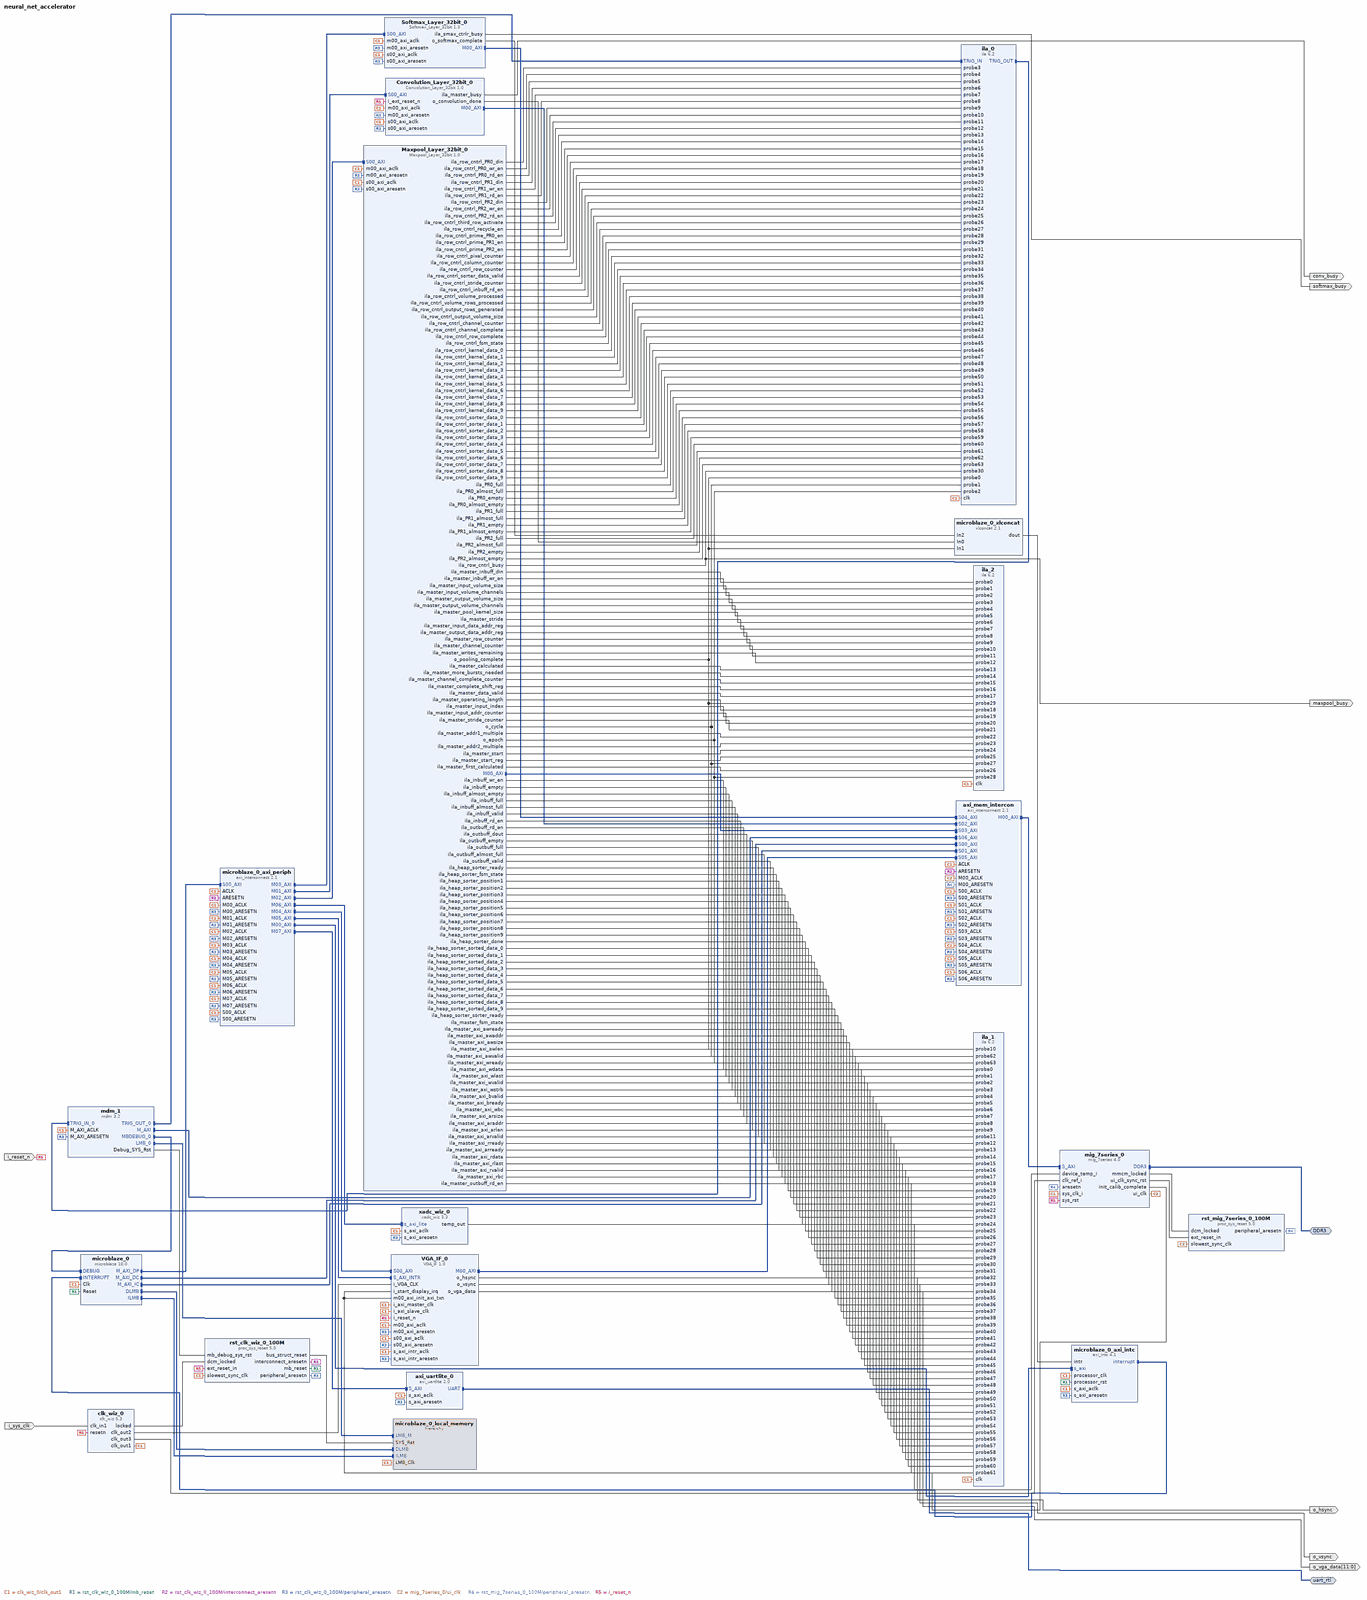
[diagram p0: block diagram of the top level, whole]
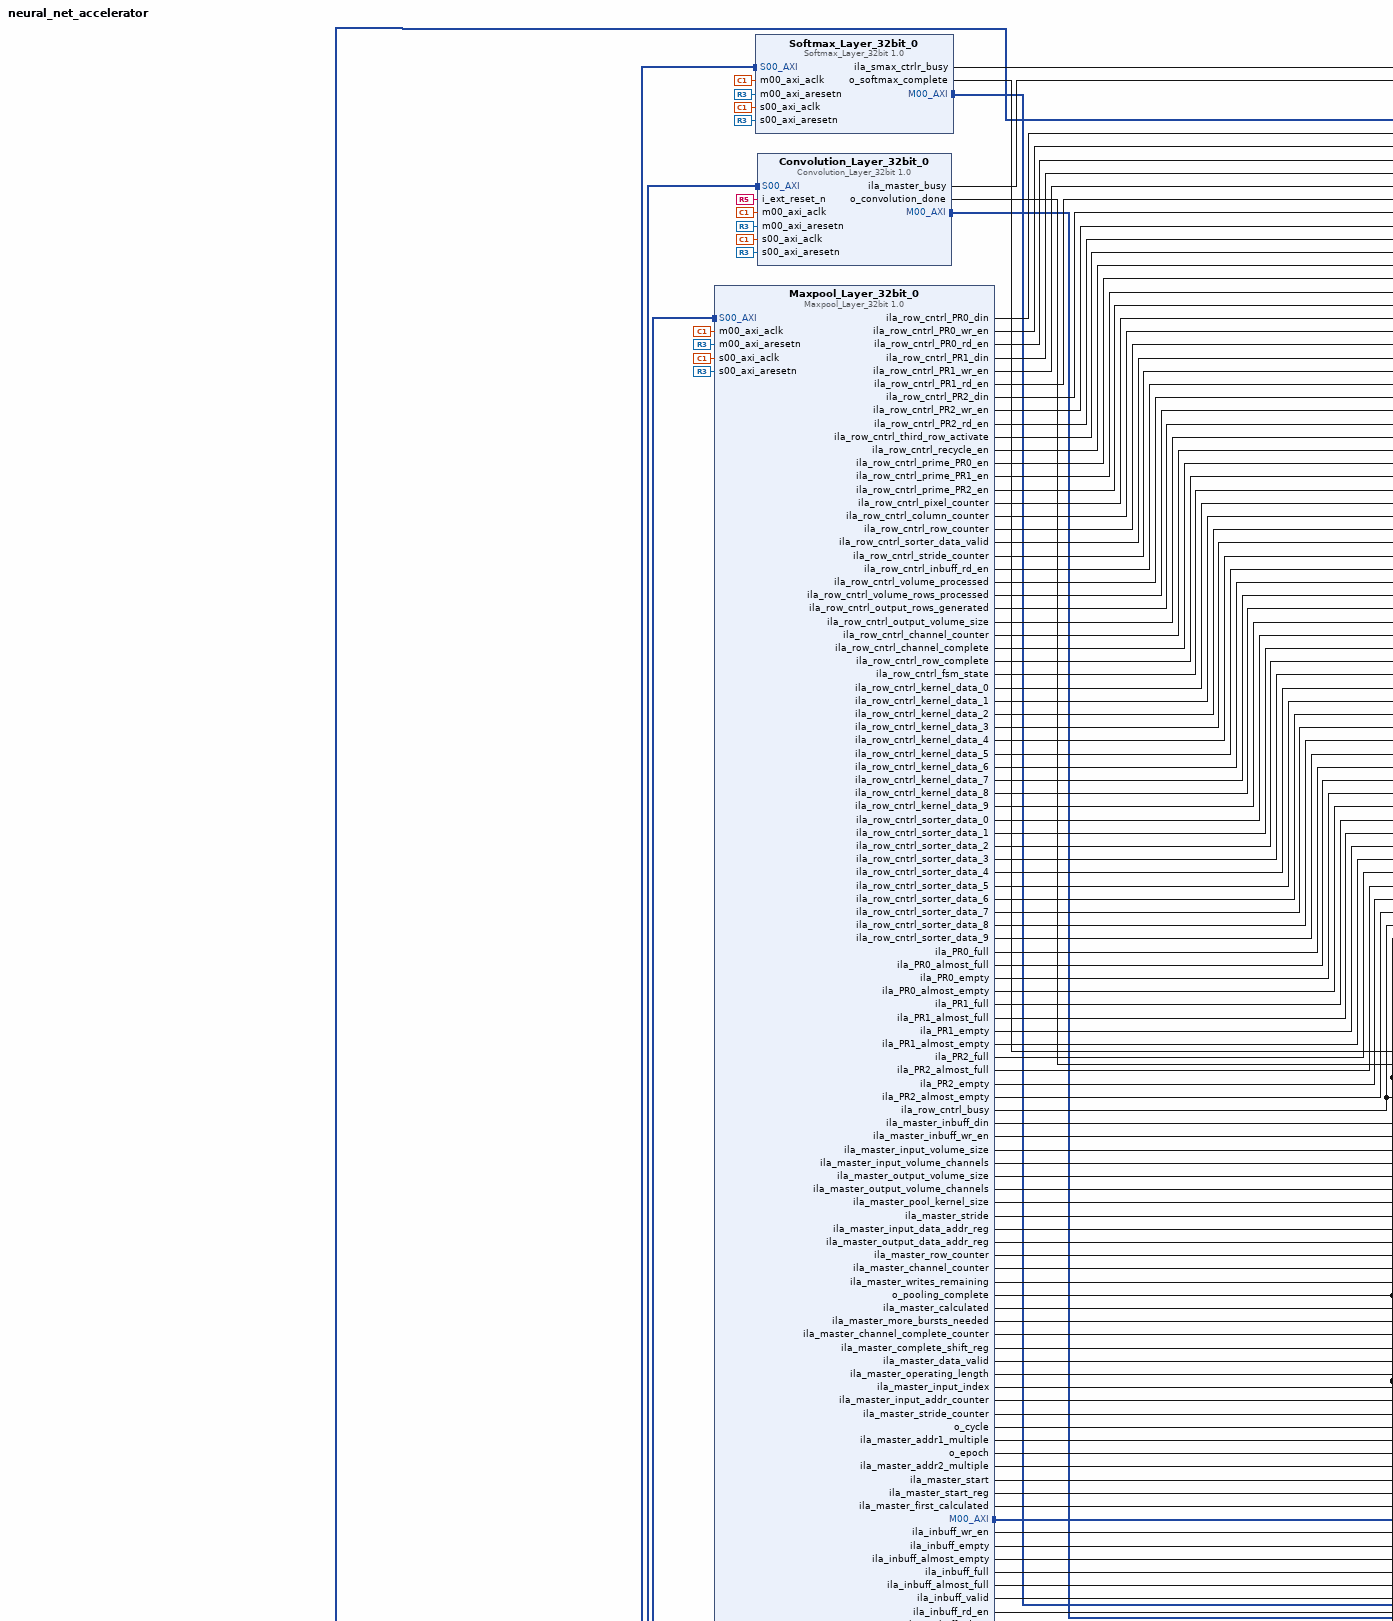
[diagram p1: block diagram of the top level, upper left part]
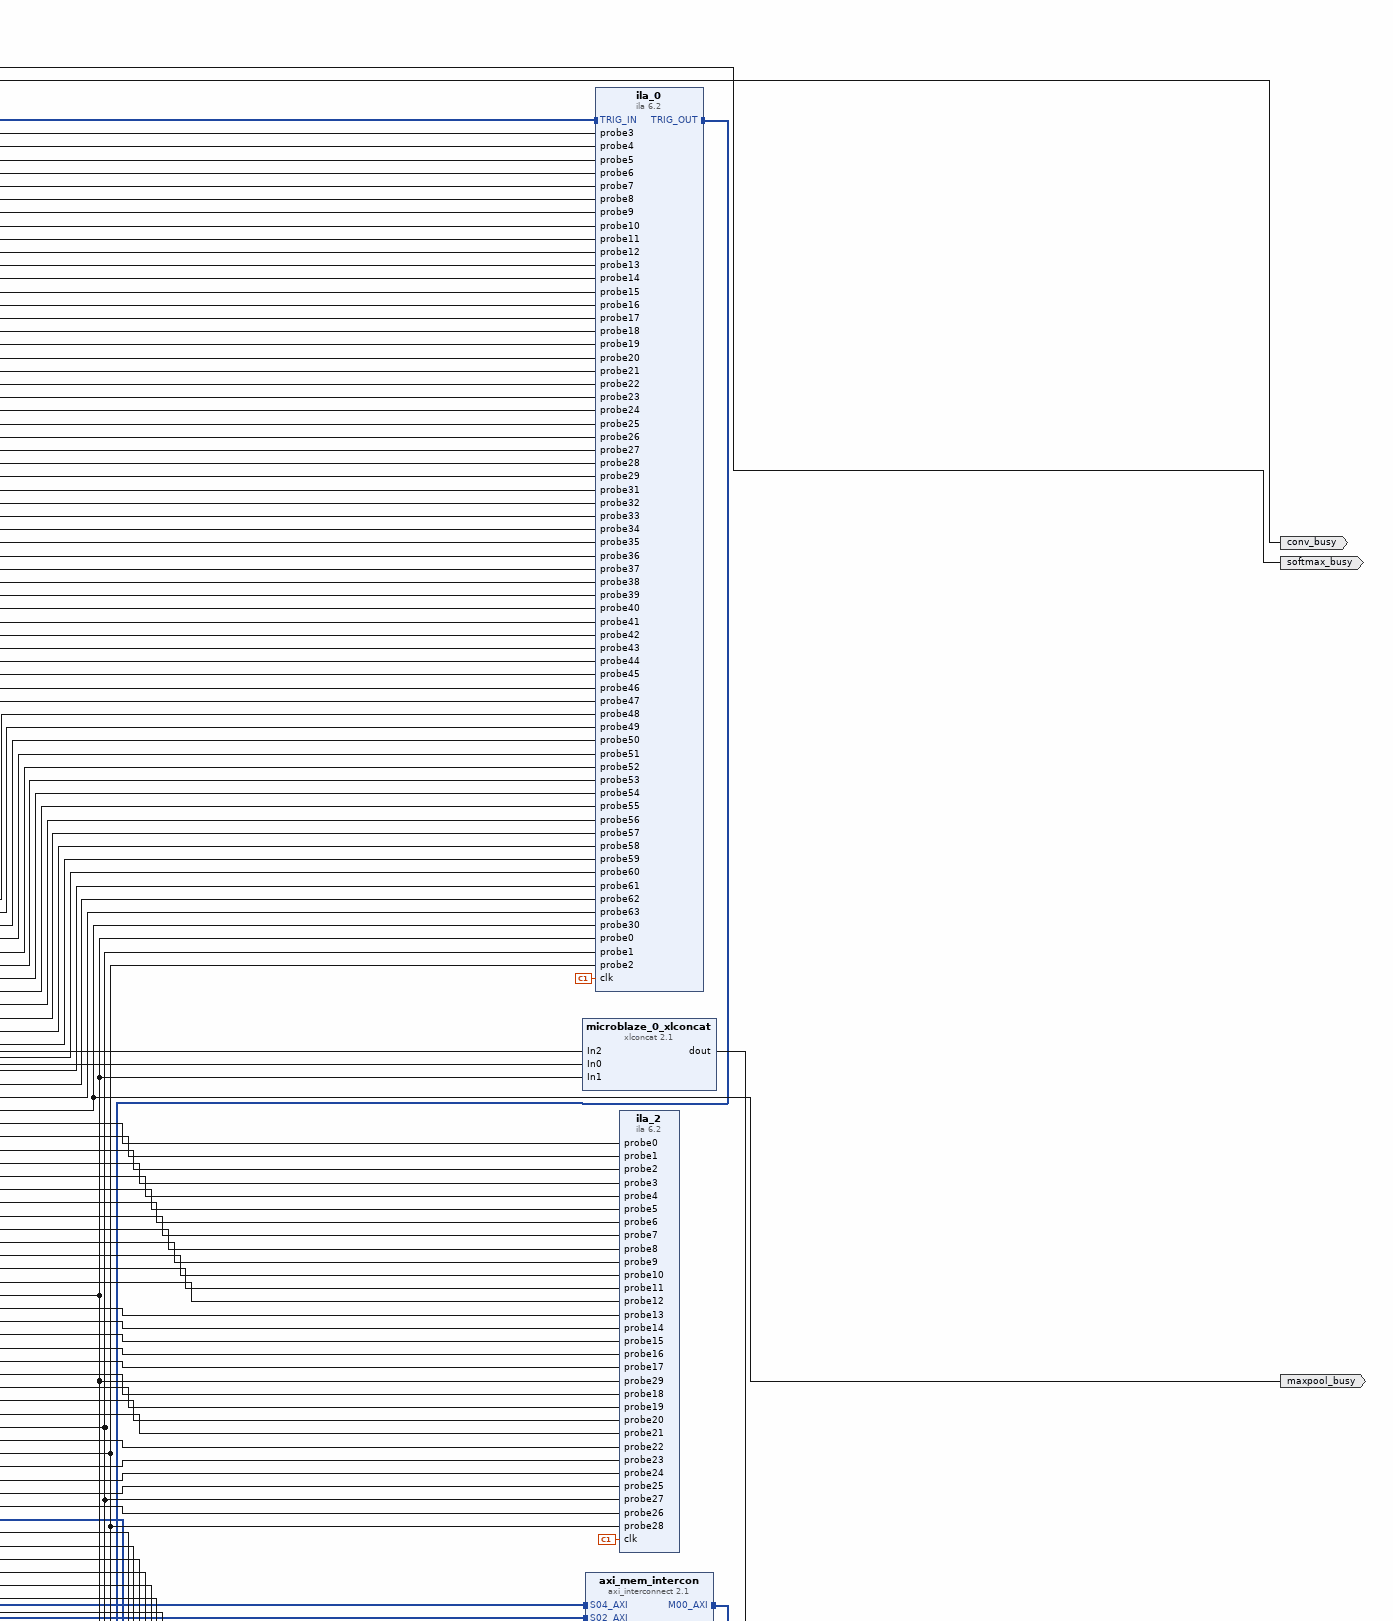
[diagram p2: block diagram of the top level, upper right part]
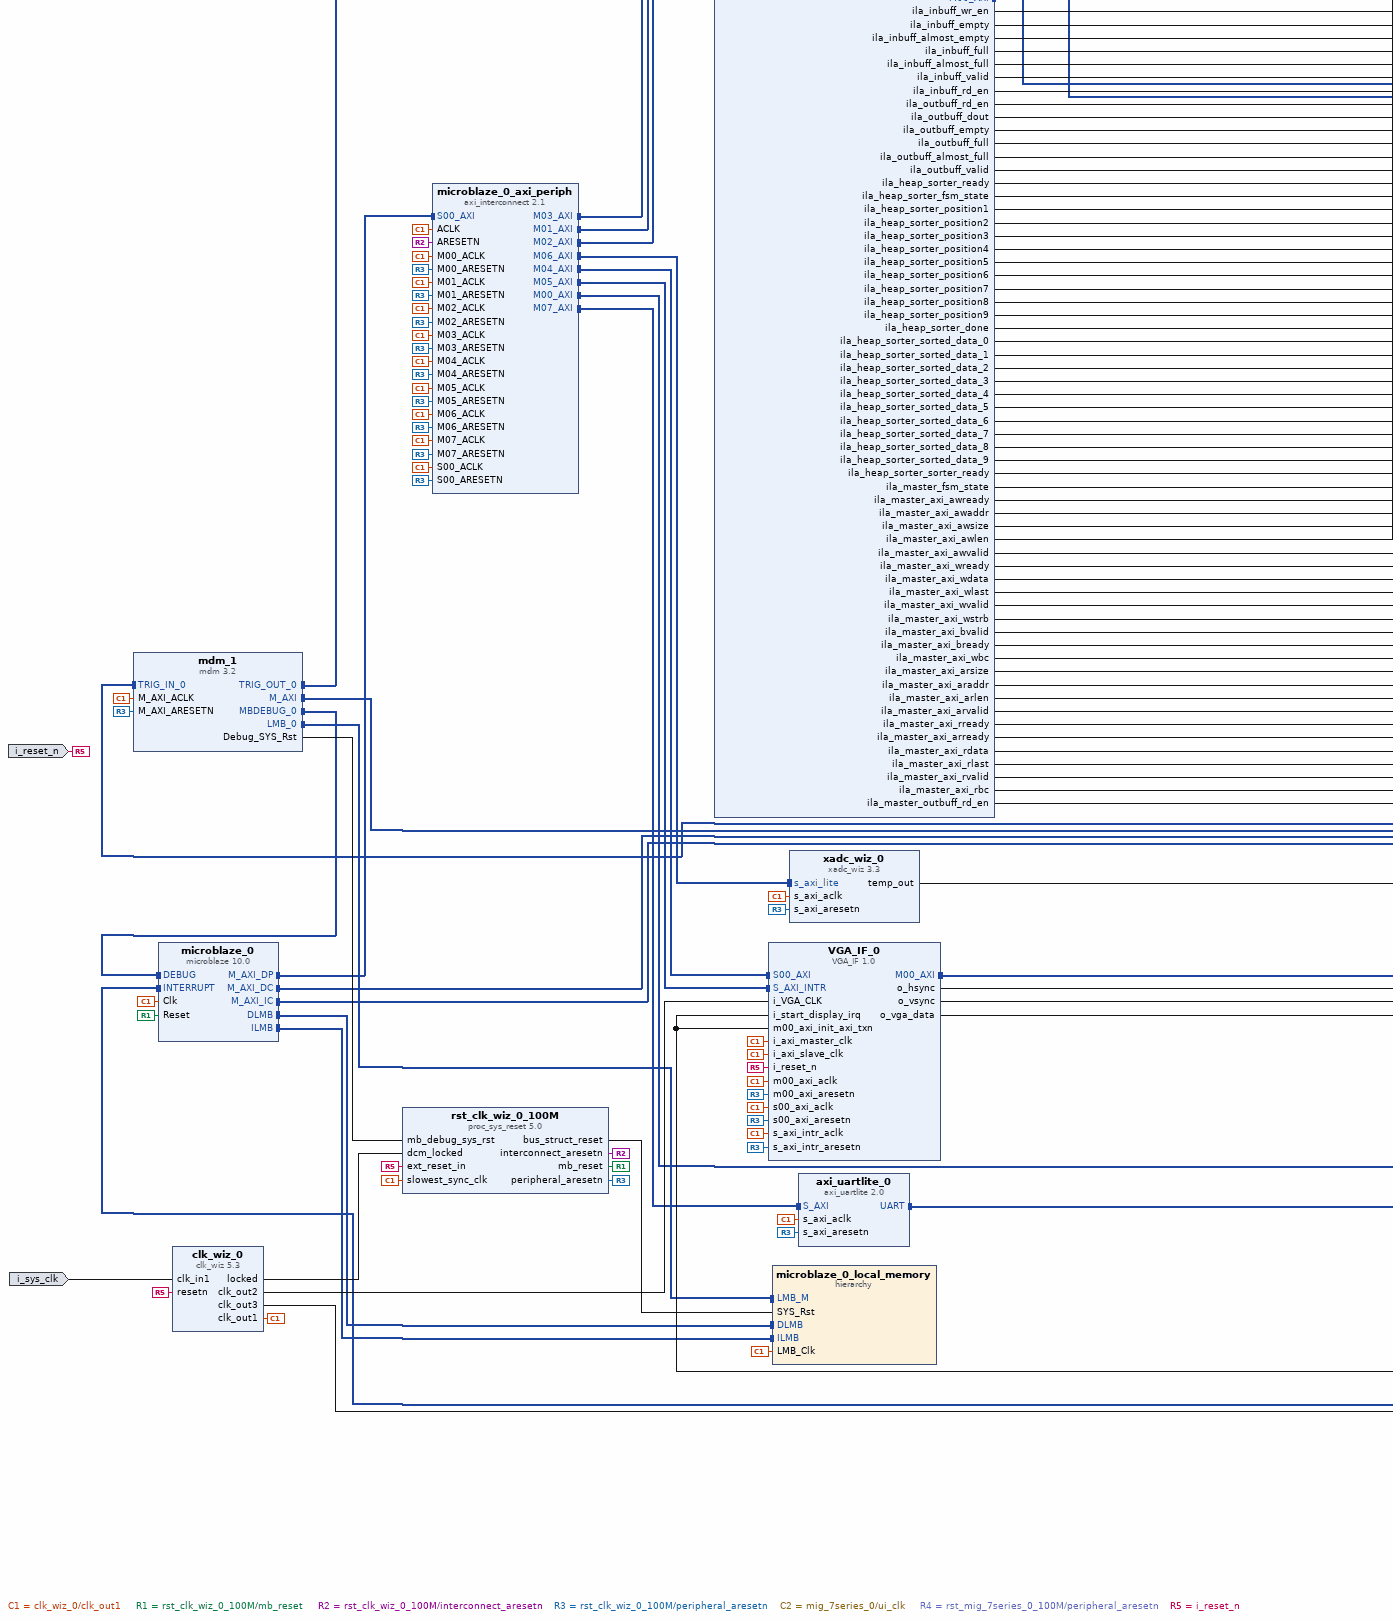
[diagram p3: block diagram of the top level, lower left part]
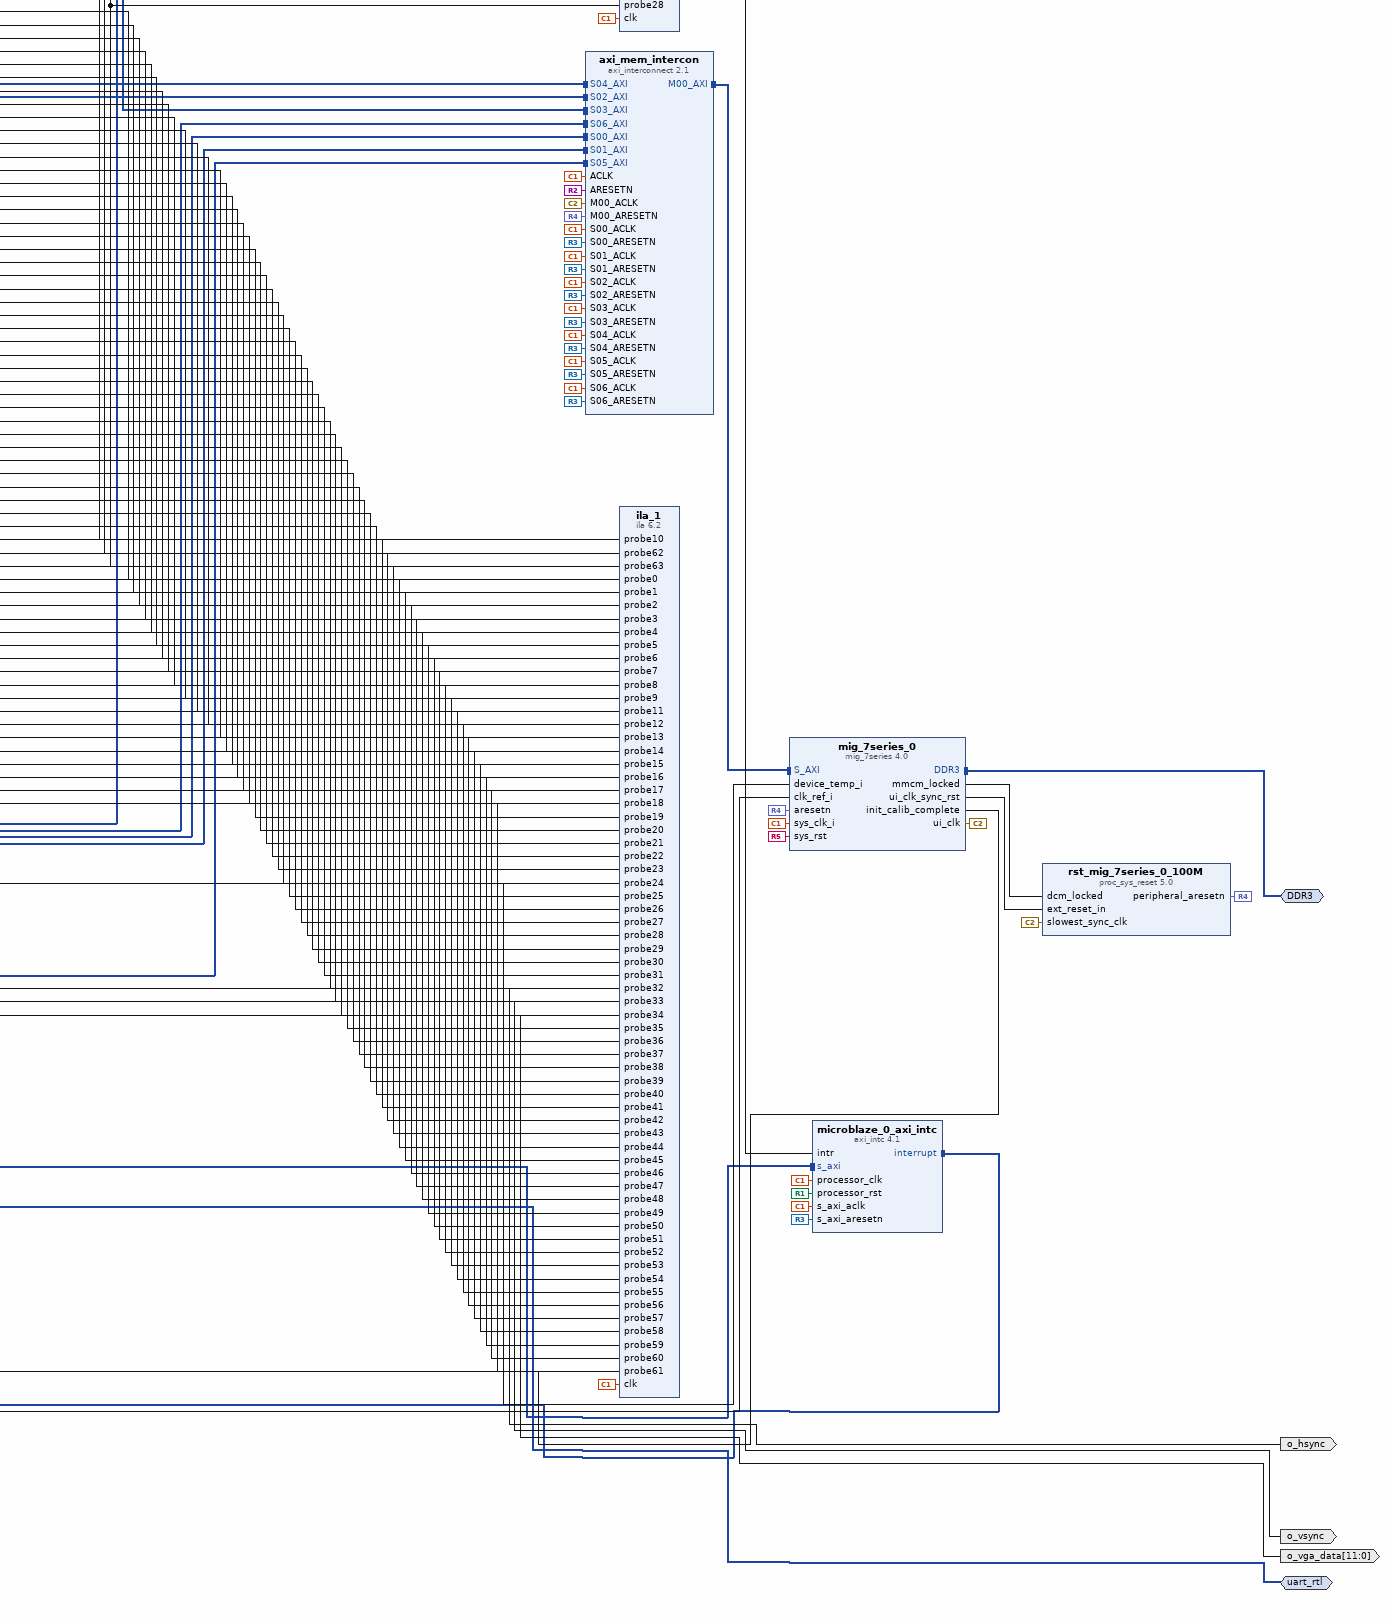
[diagram p4: block diagram of the top level, lower right part]
# Vivado block design neural_net_accelerator, xc7a200tsbg484-1, Vivado 2016.4
create_bd_design neural_net_accelerator

create_bd_intf_port -mode Master -vlnv xilinx.com:interface:ddrx_rtl:1.0 DDR3
create_bd_intf_port -mode Master -vlnv xilinx.com:interface:uart_rtl:1.0 uart_rtl
create_bd_port -dir I -type rst i_reset_n
set_property -dict {CONFIG.POLARITY ACTIVE_LOW} [get_bd_ports i_reset_n]
create_bd_port -dir I -type clk i_sys_clk
set_property -dict {CONFIG.FREQ_HZ 100000000 CONFIG.PHASE 0.000} [get_bd_ports i_sys_clk]
create_bd_port -dir O o_hsync
create_bd_port -dir O o_vsync
create_bd_port -dir O -from 11 -to 0 o_vga_data
create_bd_port -dir O maxpool_busy
create_bd_port -dir O softmax_busy
create_bd_port -dir O conv_busy

create_bd_cell -type ip -vlnv xilinx.com:user:VGA_IF:1.0 VGA_IF_0
create_bd_cell -type ip -vlnv xilinx.com:ip:xadc_wiz:3.3 xadc_wiz_0
set_property -dict {CONFIG.ENABLE_TEMP_BUS true} [get_bd_cells xadc_wiz_0]
create_bd_cell -type ip -vlnv xilinx.com:ip:mig_7series:4.0 mig_7series_0
set_property -dict [list \
  CONFIG.XML_INPUT_FILE mig_a.prj \
  CONFIG.RESET_BOARD_INTERFACE Custom \
  CONFIG.BOARD_MIG_PARAM Custom \
] [get_bd_cells mig_7series_0]
create_bd_cell -type ip -vlnv xilinx.com:ip:clk_wiz:5.3 clk_wiz_0
set_property -dict [list \
  CONFIG.CLKOUT2_USED true \
  CONFIG.CLKOUT3_USED true \
  CONFIG.NUM_OUT_CLKS 3 \
  CONFIG.CLKOUT2_REQUESTED_OUT_FREQ 25 \
  CONFIG.CLKOUT3_REQUESTED_OUT_FREQ 200 \
  CONFIG.RESET_PORT resetn \
  CONFIG.MMCM_DIVCLK_DIVIDE 1 \
  CONFIG.MMCM_CLKOUT1_DIVIDE 40 \
  CONFIG.MMCM_CLKOUT2_DIVIDE 5 \
  CONFIG.RESET_TYPE ACTIVE_LOW \
  CONFIG.CLKOUT2_JITTER 175.402 \
  CONFIG.CLKOUT2_PHASE_ERROR 98.575 \
  CONFIG.CLKOUT3_JITTER 114.829 \
  CONFIG.CLKOUT3_PHASE_ERROR 98.575 \
] [get_bd_cells clk_wiz_0]
create_bd_cell -type ip -vlnv xilinx.com:ip:axi_interconnect:2.1 microblaze_0_axi_periph
set_property -dict {CONFIG.NUM_SI 1 CONFIG.NUM_MI 8} [get_bd_cells microblaze_0_axi_periph]
create_bd_cell -type ip -vlnv xilinx.com:ip:axi_intc:4.1 microblaze_0_axi_intc
set_property -dict {CONFIG.C_HAS_FAST 1} [get_bd_cells microblaze_0_axi_intc]
create_bd_cell -type ip -vlnv xilinx.com:ip:xlconcat:2.1 microblaze_0_xlconcat
set_property -dict {CONFIG.NUM_PORTS 3} [get_bd_cells microblaze_0_xlconcat]
create_bd_cell -type ip -vlnv xilinx.com:ip:proc_sys_reset:5.0 rst_clk_wiz_0_100M
create_bd_cell -type ip -vlnv xilinx.com:ip:axi_interconnect:2.1 axi_mem_intercon
set_property -dict {CONFIG.NUM_SI 7 CONFIG.NUM_MI 1} [get_bd_cells axi_mem_intercon]
create_bd_cell -type ip -vlnv xilinx.com:ip:proc_sys_reset:5.0 rst_mig_7series_0_100M
create_bd_cell -type ip -vlnv xilinx.com:ip:axi_uartlite:2.0 axi_uartlite_0
create_bd_cell -type ip -vlnv xilinx.com:ip:microblaze:10.0 microblaze_0
set_property -dict [list \
  CONFIG.C_D_AXI 1 \
  CONFIG.C_D_LMB 1 \
  CONFIG.C_I_LMB 1 \
  CONFIG.C_DEBUG_ENABLED 2 \
  CONFIG.C_USE_ICACHE 1 \
  CONFIG.C_CACHE_BYTE_SIZE 32768 \
  CONFIG.C_ICACHE_LINE_LEN 8 \
  CONFIG.C_ICACHE_ALWAYS_USED 1 \
  CONFIG.C_USE_DCACHE 1 \
  CONFIG.C_DCACHE_BYTE_SIZE 32768 \
  CONFIG.C_DCACHE_LINE_LEN 8 \
  CONFIG.C_DCACHE_ALWAYS_USED 1 \
] [get_bd_cells microblaze_0]
create_bd_cell -type hier microblaze_0_local_memory
create_bd_cell -type ip -vlnv xilinx.com:ip:mdm:3.2 mdm_1
set_property -dict {CONFIG.C_DBG_MEM_ACCESS 1 CONFIG.C_USE_CROSS_TRIGGER 1} [get_bd_cells mdm_1]
create_bd_cell -type ip -vlnv xilinx.com:ip:ila:6.2 ila_0
set_property -dict [list \
  CONFIG.C_PROBE51_WIDTH 32 \
  CONFIG.C_PROBE50_WIDTH 32 \
  CONFIG.C_PROBE49_WIDTH 32 \
  CONFIG.C_PROBE48_WIDTH 32 \
  CONFIG.C_PROBE47_WIDTH 32 \
  CONFIG.C_PROBE46_WIDTH 32 \
  CONFIG.C_PROBE45_WIDTH 32 \
  CONFIG.C_PROBE44_WIDTH 32 \
  CONFIG.C_PROBE43_WIDTH 32 \
  CONFIG.C_PROBE42_WIDTH 32 \
  CONFIG.C_PROBE41_WIDTH 32 \
  CONFIG.C_PROBE40_WIDTH 32 \
  CONFIG.C_PROBE39_WIDTH 32 \
  CONFIG.C_PROBE38_WIDTH 32 \
  CONFIG.C_PROBE37_WIDTH 32 \
  CONFIG.C_PROBE36_WIDTH 32 \
  CONFIG.C_PROBE35_WIDTH 32 \
  CONFIG.C_PROBE34_WIDTH 32 \
  CONFIG.C_PROBE33_WIDTH 32 \
  CONFIG.C_PROBE32_WIDTH 32 \
  CONFIG.C_PROBE31_WIDTH 4 \
  CONFIG.C_PROBE27_WIDTH 16 \
  CONFIG.C_PROBE26_WIDTH 8 \
  CONFIG.C_PROBE25_WIDTH 8 \
  CONFIG.C_PROBE24_WIDTH 8 \
  CONFIG.C_PROBE21_WIDTH 4 \
  CONFIG.C_PROBE19_WIDTH 16 \
  CONFIG.C_PROBE18_WIDTH 8 \
  CONFIG.C_PROBE17_WIDTH 8 \
  CONFIG.C_PROBE9_WIDTH 32 \
  CONFIG.C_PROBE6_WIDTH 32 \
  CONFIG.C_PROBE3_WIDTH 32 \
  CONFIG.C_PROBE2_WIDTH 64 \
  CONFIG.C_PROBE1_WIDTH 64 \
  CONFIG.C_NUM_OF_PROBES 64 \
  CONFIG.C_TRIGOUT_EN true \
  CONFIG.C_TRIGIN_EN true \
  CONFIG.C_ENABLE_ILA_AXI_MON false \
  CONFIG.C_MONITOR_TYPE Native \
] [get_bd_cells ila_0]
create_bd_cell -type ip -vlnv xilinx.com:ip:ila:6.2 ila_1
set_property -dict [list \
  CONFIG.C_PROBE63_WIDTH 64 \
  CONFIG.C_PROBE62_WIDTH 64 \
  CONFIG.C_PROBE60_WIDTH 8 \
  CONFIG.C_PROBE57_WIDTH 32 \
  CONFIG.C_PROBE53_WIDTH 8 \
  CONFIG.C_PROBE52_WIDTH 32 \
  CONFIG.C_PROBE51_WIDTH 3 \
  CONFIG.C_PROBE50_WIDTH 9 \
  CONFIG.C_PROBE47_WIDTH 4 \
  CONFIG.C_PROBE44_WIDTH 32 \
  CONFIG.C_PROBE41_WIDTH 8 \
  CONFIG.C_PROBE40_WIDTH 3 \
  CONFIG.C_PROBE39_WIDTH 32 \
  CONFIG.C_PROBE37_WIDTH 4 \
  CONFIG.C_PROBE35_WIDTH 32 \
  CONFIG.C_PROBE34_WIDTH 32 \
  CONFIG.C_PROBE33_WIDTH 32 \
  CONFIG.C_PROBE32_WIDTH 32 \
  CONFIG.C_PROBE31_WIDTH 32 \
  CONFIG.C_PROBE30_WIDTH 32 \
  CONFIG.C_PROBE29_WIDTH 32 \
  CONFIG.C_PROBE28_WIDTH 32 \
  CONFIG.C_PROBE27_WIDTH 32 \
  CONFIG.C_PROBE26_WIDTH 32 \
  CONFIG.C_PROBE24_WIDTH 32 \
  CONFIG.C_PROBE23_WIDTH 32 \
  CONFIG.C_PROBE22_WIDTH 32 \
  CONFIG.C_PROBE21_WIDTH 32 \
  CONFIG.C_PROBE20_WIDTH 32 \
  CONFIG.C_PROBE19_WIDTH 32 \
  CONFIG.C_PROBE18_WIDTH 32 \
  CONFIG.C_PROBE17_WIDTH 32 \
  CONFIG.C_PROBE16_WIDTH 32 \
  CONFIG.C_PROBE15_WIDTH 4 \
  CONFIG.C_PROBE8_WIDTH 32 \
  CONFIG.C_NUM_OF_PROBES 64 \
  CONFIG.C_ENABLE_ILA_AXI_MON false \
  CONFIG.C_MONITOR_TYPE Native \
] [get_bd_cells ila_1]
create_bd_cell -type ip -vlnv xilinx.com:ip:ila:6.2 ila_2
set_property -dict [list \
  CONFIG.C_PROBE28_WIDTH 64 \
  CONFIG.C_PROBE27_WIDTH 64 \
  CONFIG.C_PROBE25_WIDTH 2 \
  CONFIG.C_PROBE23_WIDTH 8 \
  CONFIG.C_PROBE22_WIDTH 8 \
  CONFIG.C_PROBE21_WIDTH 8 \
  CONFIG.C_PROBE20_WIDTH 32 \
  CONFIG.C_PROBE19_WIDTH 32 \
  CONFIG.C_PROBE18_WIDTH 9 \
  CONFIG.C_PROBE16_WIDTH 2 \
  CONFIG.C_PROBE15_WIDTH 8 \
  CONFIG.C_PROBE12_WIDTH 16 \
  CONFIG.C_PROBE11_WIDTH 16 \
  CONFIG.C_PROBE10_WIDTH 8 \
  CONFIG.C_PROBE9_WIDTH 32 \
  CONFIG.C_PROBE8_WIDTH 32 \
  CONFIG.C_PROBE7_WIDTH 4 \
  CONFIG.C_PROBE6_WIDTH 4 \
  CONFIG.C_PROBE5_WIDTH 16 \
  CONFIG.C_PROBE4_WIDTH 8 \
  CONFIG.C_PROBE3_WIDTH 16 \
  CONFIG.C_PROBE2_WIDTH 8 \
  CONFIG.C_PROBE0_WIDTH 32 \
  CONFIG.C_NUM_OF_PROBES 30 \
  CONFIG.C_ENABLE_ILA_AXI_MON false \
  CONFIG.C_MONITOR_TYPE Native \
] [get_bd_cells ila_2]
create_bd_cell -type ip -vlnv xilinx.com:user:Softmax_Layer_32bit:1.0 Softmax_Layer_32bit_0
create_bd_cell -type ip -vlnv xilinx.com:user:Convolution_Layer_32bit:1.0 Convolution_Layer_32bit_0
create_bd_cell -type ip -vlnv xilinx.com:user:Maxpool_Layer_32bit:1.0 Maxpool_Layer_32bit_0

# ---- hierarchy /microblaze_0_local_memory ----
current_bd_instance /microblaze_0_local_memory
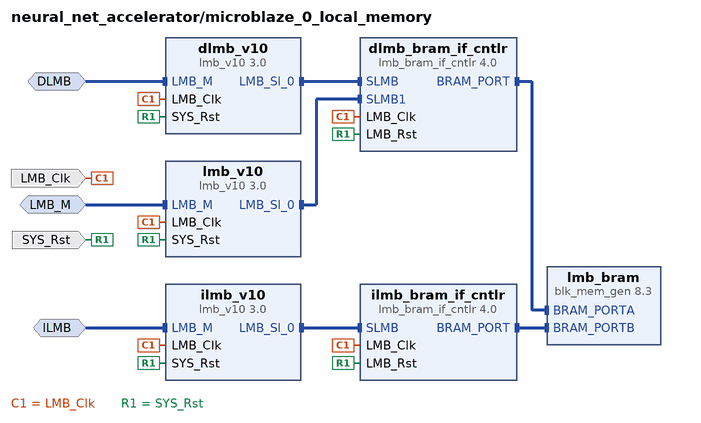
[diagram p5: block diagram inside /microblaze_0_local_memory]
create_bd_intf_pin -mode MirroredMaster -vlnv xilinx.com:interface:lmb_rtl:1.0 DLMB
create_bd_intf_pin -mode MirroredMaster -vlnv xilinx.com:interface:lmb_rtl:1.0 ILMB
create_bd_intf_pin -mode MirroredMaster -vlnv xilinx.com:interface:lmb_rtl:1.0 LMB_M
create_bd_pin -dir I -type clk LMB_Clk
create_bd_pin -dir I -type rst SYS_Rst

create_bd_cell -type ip -vlnv xilinx.com:ip:lmb_v10:3.0 dlmb_v10
create_bd_cell -type ip -vlnv xilinx.com:ip:lmb_v10:3.0 ilmb_v10
create_bd_cell -type ip -vlnv xilinx.com:ip:lmb_bram_if_cntlr:4.0 dlmb_bram_if_cntlr
set_property -dict {CONFIG.C_NUM_LMB 2 CONFIG.C_ECC 0} [get_bd_cells dlmb_bram_if_cntlr]
create_bd_cell -type ip -vlnv xilinx.com:ip:lmb_bram_if_cntlr:4.0 ilmb_bram_if_cntlr
set_property -dict {CONFIG.C_ECC 0} [get_bd_cells ilmb_bram_if_cntlr]
create_bd_cell -type ip -vlnv xilinx.com:ip:blk_mem_gen:8.3 lmb_bram
set_property -dict {CONFIG.Memory_Type True_Dual_Port_RAM CONFIG.use_bram_block BRAM_Controller} [get_bd_cells lmb_bram]
create_bd_cell -type ip -vlnv xilinx.com:ip:lmb_v10:3.0 lmb_v10

# ---- connections ----

current_bd_instance /microblaze_0_local_memory
connect_bd_intf_net -intf_net microblaze_0_dlmb_bus [get_bd_intf_pins dlmb_v10/LMB_Sl_0] [get_bd_intf_pins dlmb_bram_if_cntlr/SLMB]
connect_bd_intf_net -intf_net microblaze_0_ilmb_bus [get_bd_intf_pins ilmb_v10/LMB_Sl_0] [get_bd_intf_pins ilmb_bram_if_cntlr/SLMB]
connect_bd_intf_net -intf_net microblaze_0_dlmb_cntlr [get_bd_intf_pins dlmb_bram_if_cntlr/BRAM_PORT] [get_bd_intf_pins lmb_bram/BRAM_PORTA]
connect_bd_intf_net -intf_net microblaze_0_ilmb_cntlr [get_bd_intf_pins ilmb_bram_if_cntlr/BRAM_PORT] [get_bd_intf_pins lmb_bram/BRAM_PORTB]
connect_bd_intf_net -intf_net microblaze_0_lmb_bus [get_bd_intf_pins lmb_v10/LMB_Sl_0] [get_bd_intf_pins dlmb_bram_if_cntlr/SLMB1]
connect_bd_intf_net -intf_net microblaze_0_dlmb [get_bd_intf_pins DLMB] [get_bd_intf_pins dlmb_v10/LMB_M]
connect_bd_intf_net -intf_net microblaze_0_ilmb [get_bd_intf_pins ILMB] [get_bd_intf_pins ilmb_v10/LMB_M]
connect_bd_intf_net -intf_net microblaze_0_lmb [get_bd_intf_pins LMB_M] [get_bd_intf_pins lmb_v10/LMB_M]
connect_bd_net -net microblaze_0_Clk [get_bd_pins LMB_Clk] \
  [get_bd_pins dlmb_v10/LMB_Clk] [get_bd_pins dlmb_bram_if_cntlr/LMB_Clk] [get_bd_pins ilmb_v10/LMB_Clk] \
  [get_bd_pins ilmb_bram_if_cntlr/LMB_Clk] [get_bd_pins lmb_v10/LMB_Clk]
connect_bd_net [get_bd_pins SYS_Rst] \
  [get_bd_pins dlmb_v10/SYS_Rst] [get_bd_pins dlmb_bram_if_cntlr/LMB_Rst] [get_bd_pins ilmb_v10/SYS_Rst] \
  [get_bd_pins ilmb_bram_if_cntlr/LMB_Rst] [get_bd_pins lmb_v10/SYS_Rst]

current_bd_instance /
connect_bd_intf_net -intf_net microblaze_0_intc_axi [get_bd_intf_pins microblaze_0_axi_periph/M00_AXI] [get_bd_intf_pins microblaze_0_axi_intc/s_axi]
connect_bd_intf_net [get_bd_intf_pins microblaze_0_axi_periph/M01_AXI] [get_bd_intf_pins Convolution_Layer_32bit_0/S00_AXI]
connect_bd_intf_net [get_bd_intf_pins microblaze_0_axi_periph/M02_AXI] [get_bd_intf_pins Maxpool_Layer_32bit_0/S00_AXI]
connect_bd_intf_net [get_bd_intf_pins microblaze_0_axi_periph/M03_AXI] [get_bd_intf_pins Softmax_Layer_32bit_0/S00_AXI]
connect_bd_intf_net [get_bd_intf_pins microblaze_0_axi_periph/M04_AXI] [get_bd_intf_pins VGA_IF_0/S00_AXI]
connect_bd_intf_net [get_bd_intf_pins microblaze_0_axi_periph/M05_AXI] [get_bd_intf_pins VGA_IF_0/S_AXI_INTR]
connect_bd_intf_net [get_bd_intf_pins microblaze_0_axi_periph/M06_AXI] [get_bd_intf_pins xadc_wiz_0/s_axi_lite]
connect_bd_intf_net [get_bd_intf_pins axi_mem_intercon/M00_AXI] [get_bd_intf_pins mig_7series_0/S_AXI]
connect_bd_intf_net [get_bd_intf_pins microblaze_0_axi_periph/M07_AXI] [get_bd_intf_pins axi_uartlite_0/S_AXI]
connect_bd_intf_net [get_bd_intf_pins Convolution_Layer_32bit_0/M00_AXI] [get_bd_intf_pins axi_mem_intercon/S02_AXI]
connect_bd_intf_net [get_bd_intf_pins Maxpool_Layer_32bit_0/M00_AXI] [get_bd_intf_pins axi_mem_intercon/S03_AXI]
connect_bd_intf_net [get_bd_intf_pins Softmax_Layer_32bit_0/M00_AXI] [get_bd_intf_pins axi_mem_intercon/S04_AXI]
connect_bd_intf_net [get_bd_intf_pins VGA_IF_0/M00_AXI] [get_bd_intf_pins axi_mem_intercon/S05_AXI]
connect_bd_intf_net [get_bd_intf_pins microblaze_0/DLMB] [get_bd_intf_pins microblaze_0_local_memory/DLMB]
connect_bd_intf_net [get_bd_intf_pins microblaze_0/ILMB] [get_bd_intf_pins microblaze_0_local_memory/ILMB]
connect_bd_intf_net [get_bd_intf_pins mdm_1/MBDEBUG_0] [get_bd_intf_pins microblaze_0/DEBUG]
connect_bd_intf_net -intf_net microblaze_0_lmb [get_bd_intf_pins mdm_1/LMB_0] [get_bd_intf_pins microblaze_0_local_memory/LMB_M]
connect_bd_intf_net [get_bd_intf_pins microblaze_0/M_AXI_DP] [get_bd_intf_pins microblaze_0_axi_periph/S00_AXI]
connect_bd_intf_net [get_bd_intf_pins microblaze_0/M_AXI_DC] [get_bd_intf_pins axi_mem_intercon/S00_AXI]
connect_bd_intf_net [get_bd_intf_pins microblaze_0/M_AXI_IC] [get_bd_intf_pins axi_mem_intercon/S01_AXI]
connect_bd_intf_net [get_bd_intf_pins mdm_1/M_AXI] [get_bd_intf_pins axi_mem_intercon/S06_AXI]
connect_bd_intf_net [get_bd_intf_pins microblaze_0_axi_intc/interrupt] [get_bd_intf_pins microblaze_0/INTERRUPT]
connect_bd_intf_net [get_bd_intf_pins mdm_1/TRIG_IN_0] [get_bd_intf_pins ila_0/TRIG_OUT]
connect_bd_intf_net [get_bd_intf_pins mdm_1/TRIG_OUT_0] [get_bd_intf_pins ila_0/TRIG_IN]
connect_bd_intf_net [get_bd_intf_ports DDR3] [get_bd_intf_pins mig_7series_0/DDR3]
connect_bd_intf_net [get_bd_intf_ports uart_rtl] [get_bd_intf_pins axi_uartlite_0/UART]
connect_bd_net -net microblaze_0_intr [get_bd_pins microblaze_0_xlconcat/dout] [get_bd_pins microblaze_0_axi_intc/intr]
connect_bd_net -net microblaze_0_Clk [get_bd_pins clk_wiz_0/clk_out1] \
  [get_bd_pins microblaze_0_axi_intc/s_axi_aclk] [get_bd_pins microblaze_0_axi_intc/processor_clk] \
  [get_bd_pins rst_clk_wiz_0_100M/slowest_sync_clk] [get_bd_pins VGA_IF_0/s00_axi_aclk] [get_bd_pins VGA_IF_0/m00_axi_aclk] \
  [get_bd_pins VGA_IF_0/s_axi_intr_aclk] [get_bd_pins xadc_wiz_0/s_axi_aclk] [get_bd_pins mig_7series_0/sys_clk_i] \
  [get_bd_pins VGA_IF_0/i_axi_master_clk] [get_bd_pins VGA_IF_0/i_axi_slave_clk] [get_bd_pins axi_uartlite_0/s_axi_aclk] \
  [get_bd_pins microblaze_0/Clk] [get_bd_pins mdm_1/M_AXI_ACLK] [get_bd_pins ila_0/clk] [get_bd_pins ila_1/clk] \
  [get_bd_pins ila_2/clk] [get_bd_pins Softmax_Layer_32bit_0/s00_axi_aclk] [get_bd_pins Softmax_Layer_32bit_0/m00_axi_aclk] \
  [get_bd_pins Convolution_Layer_32bit_0/m00_axi_aclk] [get_bd_pins Convolution_Layer_32bit_0/s00_axi_aclk] \
  [get_bd_pins microblaze_0_axi_periph/ACLK] [get_bd_pins microblaze_0_axi_periph/S00_ACLK] \
  [get_bd_pins microblaze_0_axi_periph/M00_ACLK] [get_bd_pins microblaze_0_axi_periph/M01_ACLK] \
  [get_bd_pins microblaze_0_axi_periph/M02_ACLK] [get_bd_pins microblaze_0_axi_periph/M03_ACLK] \
  [get_bd_pins microblaze_0_axi_periph/M04_ACLK] [get_bd_pins microblaze_0_axi_periph/M05_ACLK] \
  [get_bd_pins microblaze_0_axi_periph/M06_ACLK] [get_bd_pins axi_mem_intercon/S00_ACLK] [get_bd_pins axi_mem_intercon/ACLK] \
  [get_bd_pins axi_mem_intercon/S01_ACLK] [get_bd_pins microblaze_0_axi_periph/M07_ACLK] \
  [get_bd_pins axi_mem_intercon/S02_ACLK] [get_bd_pins axi_mem_intercon/S03_ACLK] [get_bd_pins axi_mem_intercon/S04_ACLK] \
  [get_bd_pins axi_mem_intercon/S05_ACLK] [get_bd_pins microblaze_0_local_memory/LMB_Clk] \
  [get_bd_pins axi_mem_intercon/S06_ACLK] [get_bd_pins Maxpool_Layer_32bit_0/s00_axi_aclk] \
  [get_bd_pins Maxpool_Layer_32bit_0/m00_axi_aclk]
connect_bd_net [get_bd_pins clk_wiz_0/locked] [get_bd_pins rst_clk_wiz_0_100M/dcm_locked]
connect_bd_net [get_bd_pins rst_clk_wiz_0_100M/mb_reset] [get_bd_pins microblaze_0_axi_intc/processor_rst] [get_bd_pins microblaze_0/Reset]
connect_bd_net [get_bd_pins rst_clk_wiz_0_100M/interconnect_aresetn] \
  [get_bd_pins microblaze_0_axi_periph/ARESETN] [get_bd_pins axi_mem_intercon/ARESETN]
connect_bd_net [get_bd_pins rst_clk_wiz_0_100M/peripheral_aresetn] \
  [get_bd_pins microblaze_0_axi_intc/s_axi_aresetn] [get_bd_pins VGA_IF_0/s00_axi_aresetn] \
  [get_bd_pins VGA_IF_0/m00_axi_aresetn] [get_bd_pins VGA_IF_0/s_axi_intr_aresetn] [get_bd_pins xadc_wiz_0/s_axi_aresetn] \
  [get_bd_pins axi_uartlite_0/s_axi_aresetn] [get_bd_pins mdm_1/M_AXI_ARESETN] \
  [get_bd_pins Softmax_Layer_32bit_0/s00_axi_aresetn] [get_bd_pins Softmax_Layer_32bit_0/m00_axi_aresetn] \
  [get_bd_pins Convolution_Layer_32bit_0/m00_axi_aresetn] [get_bd_pins Convolution_Layer_32bit_0/s00_axi_aresetn] \
  [get_bd_pins microblaze_0_axi_periph/S00_ARESETN] [get_bd_pins microblaze_0_axi_periph/M00_ARESETN] \
  [get_bd_pins microblaze_0_axi_periph/M01_ARESETN] [get_bd_pins microblaze_0_axi_periph/M02_ARESETN] \
  [get_bd_pins microblaze_0_axi_periph/M03_ARESETN] [get_bd_pins microblaze_0_axi_periph/M04_ARESETN] \
  [get_bd_pins microblaze_0_axi_periph/M05_ARESETN] [get_bd_pins microblaze_0_axi_periph/M06_ARESETN] \
  [get_bd_pins axi_mem_intercon/S00_ARESETN] [get_bd_pins axi_mem_intercon/S01_ARESETN] \
  [get_bd_pins microblaze_0_axi_periph/M07_ARESETN] [get_bd_pins axi_mem_intercon/S02_ARESETN] \
  [get_bd_pins axi_mem_intercon/S03_ARESETN] [get_bd_pins axi_mem_intercon/S04_ARESETN] \
  [get_bd_pins axi_mem_intercon/S05_ARESETN] [get_bd_pins axi_mem_intercon/S06_ARESETN] \
  [get_bd_pins Maxpool_Layer_32bit_0/s00_axi_aresetn] [get_bd_pins Maxpool_Layer_32bit_0/m00_axi_aresetn]
connect_bd_net [get_bd_pins mig_7series_0/ui_clk] [get_bd_pins rst_mig_7series_0_100M/slowest_sync_clk] [get_bd_pins axi_mem_intercon/M00_ACLK]
connect_bd_net [get_bd_pins mig_7series_0/mmcm_locked] [get_bd_pins rst_mig_7series_0_100M/dcm_locked]
connect_bd_net [get_bd_pins mig_7series_0/ui_clk_sync_rst] [get_bd_pins rst_mig_7series_0_100M/ext_reset_in]
connect_bd_net [get_bd_pins rst_mig_7series_0_100M/peripheral_aresetn] [get_bd_pins mig_7series_0/aresetn] [get_bd_pins axi_mem_intercon/M00_ARESETN]
connect_bd_net -net reset_rtl_1 [get_bd_ports i_reset_n] \
  [get_bd_pins mig_7series_0/sys_rst] [get_bd_pins clk_wiz_0/resetn] [get_bd_pins rst_clk_wiz_0_100M/ext_reset_in] \
  [get_bd_pins VGA_IF_0/i_reset_n] [get_bd_pins Convolution_Layer_32bit_0/i_ext_reset_n]
connect_bd_net -net clock_rtl_1 [get_bd_ports i_sys_clk] [get_bd_pins clk_wiz_0/clk_in1]
connect_bd_net [get_bd_pins clk_wiz_0/clk_out3] [get_bd_pins mig_7series_0/clk_ref_i]
connect_bd_net [get_bd_pins xadc_wiz_0/temp_out] [get_bd_pins mig_7series_0/device_temp_i]
connect_bd_net [get_bd_pins mig_7series_0/init_calib_complete] [get_bd_pins VGA_IF_0/i_start_display_irq] [get_bd_pins VGA_IF_0/m00_axi_init_axi_txn]
connect_bd_net [get_bd_pins clk_wiz_0/clk_out2] [get_bd_pins VGA_IF_0/i_VGA_CLK]
connect_bd_net [get_bd_pins VGA_IF_0/o_hsync] [get_bd_ports o_hsync]
connect_bd_net [get_bd_pins VGA_IF_0/o_vsync] [get_bd_ports o_vsync]
connect_bd_net [get_bd_pins VGA_IF_0/o_vga_data] [get_bd_ports o_vga_data]
connect_bd_net [get_bd_pins Softmax_Layer_32bit_0/o_softmax_complete] [get_bd_pins microblaze_0_xlconcat/In2]
connect_bd_net [get_bd_pins Convolution_Layer_32bit_0/o_convolution_done] [get_bd_pins microblaze_0_xlconcat/In0]
connect_bd_net [get_bd_pins Maxpool_Layer_32bit_0/o_pooling_complete] \
  [get_bd_pins microblaze_0_xlconcat/In1] [get_bd_pins ila_0/probe0] [get_bd_pins ila_1/probe10] [get_bd_pins ila_2/probe29]
connect_bd_net [get_bd_pins rst_clk_wiz_0_100M/bus_struct_reset] [get_bd_pins microblaze_0_local_memory/SYS_Rst]
connect_bd_net [get_bd_pins mdm_1/Debug_SYS_Rst] [get_bd_pins rst_clk_wiz_0_100M/mb_debug_sys_rst]
connect_bd_net [get_bd_pins Maxpool_Layer_32bit_0/o_cycle] [get_bd_pins ila_0/probe1] [get_bd_pins ila_1/probe62] [get_bd_pins ila_2/probe27]
connect_bd_net [get_bd_pins Maxpool_Layer_32bit_0/o_epoch] [get_bd_pins ila_0/probe2] [get_bd_pins ila_1/probe63] [get_bd_pins ila_2/probe28]
connect_bd_net [get_bd_pins Maxpool_Layer_32bit_0/ila_row_cntrl_PR0_din] [get_bd_pins ila_0/probe3]
connect_bd_net [get_bd_pins Maxpool_Layer_32bit_0/ila_row_cntrl_PR0_wr_en] [get_bd_pins ila_0/probe4]
connect_bd_net [get_bd_pins Maxpool_Layer_32bit_0/ila_row_cntrl_PR0_rd_en] [get_bd_pins ila_0/probe5]
connect_bd_net [get_bd_pins Maxpool_Layer_32bit_0/ila_row_cntrl_PR1_din] [get_bd_pins ila_0/probe6]
connect_bd_net [get_bd_pins Maxpool_Layer_32bit_0/ila_row_cntrl_PR1_wr_en] [get_bd_pins ila_0/probe7]
connect_bd_net [get_bd_pins Maxpool_Layer_32bit_0/ila_row_cntrl_PR1_rd_en] [get_bd_pins ila_0/probe8]
connect_bd_net [get_bd_pins Maxpool_Layer_32bit_0/ila_row_cntrl_PR2_din] [get_bd_pins ila_0/probe9]
connect_bd_net [get_bd_pins Maxpool_Layer_32bit_0/ila_row_cntrl_PR2_wr_en] [get_bd_pins ila_0/probe10]
connect_bd_net [get_bd_pins Maxpool_Layer_32bit_0/ila_row_cntrl_PR2_rd_en] [get_bd_pins ila_0/probe11]
connect_bd_net [get_bd_pins Maxpool_Layer_32bit_0/ila_row_cntrl_third_row_activate] [get_bd_pins ila_0/probe12]
connect_bd_net [get_bd_pins Maxpool_Layer_32bit_0/ila_row_cntrl_recycle_en] [get_bd_pins ila_0/probe13]
connect_bd_net [get_bd_pins Maxpool_Layer_32bit_0/ila_row_cntrl_prime_PR0_en] [get_bd_pins ila_0/probe14]
connect_bd_net [get_bd_pins Maxpool_Layer_32bit_0/ila_row_cntrl_prime_PR1_en] [get_bd_pins ila_0/probe15]
connect_bd_net [get_bd_pins Maxpool_Layer_32bit_0/ila_row_cntrl_prime_PR2_en] [get_bd_pins ila_0/probe16]
connect_bd_net [get_bd_pins Maxpool_Layer_32bit_0/ila_row_cntrl_pixel_counter] [get_bd_pins ila_0/probe17]
connect_bd_net [get_bd_pins Maxpool_Layer_32bit_0/ila_row_cntrl_column_counter] [get_bd_pins ila_0/probe18]
connect_bd_net [get_bd_pins Maxpool_Layer_32bit_0/ila_row_cntrl_row_counter] [get_bd_pins ila_0/probe19]
connect_bd_net [get_bd_pins Maxpool_Layer_32bit_0/ila_row_cntrl_sorter_data_valid] [get_bd_pins ila_0/probe20]
connect_bd_net [get_bd_pins Maxpool_Layer_32bit_0/ila_row_cntrl_stride_counter] [get_bd_pins ila_0/probe21]
connect_bd_net [get_bd_pins Maxpool_Layer_32bit_0/ila_row_cntrl_inbuff_rd_en] [get_bd_pins ila_0/probe22]
connect_bd_net [get_bd_pins Maxpool_Layer_32bit_0/ila_row_cntrl_volume_processed] [get_bd_pins ila_0/probe23]
connect_bd_net [get_bd_pins Maxpool_Layer_32bit_0/ila_row_cntrl_volume_rows_processed] [get_bd_pins ila_0/probe24]
connect_bd_net [get_bd_pins Maxpool_Layer_32bit_0/ila_row_cntrl_output_rows_generated] [get_bd_pins ila_0/probe25]
connect_bd_net [get_bd_pins Maxpool_Layer_32bit_0/ila_row_cntrl_output_volume_size] [get_bd_pins ila_0/probe26]
connect_bd_net [get_bd_pins Maxpool_Layer_32bit_0/ila_row_cntrl_channel_counter] [get_bd_pins ila_0/probe27]
connect_bd_net [get_bd_pins Maxpool_Layer_32bit_0/ila_row_cntrl_channel_complete] [get_bd_pins ila_0/probe28]
connect_bd_net [get_bd_pins Maxpool_Layer_32bit_0/ila_row_cntrl_row_complete] [get_bd_pins ila_0/probe29]
connect_bd_net [get_bd_pins Maxpool_Layer_32bit_0/ila_row_cntrl_busy] [get_bd_ports maxpool_busy] [get_bd_pins ila_0/probe30]
connect_bd_net [get_bd_pins Maxpool_Layer_32bit_0/ila_row_cntrl_fsm_state] [get_bd_pins ila_0/probe31]
connect_bd_net [get_bd_pins Maxpool_Layer_32bit_0/ila_row_cntrl_kernel_data_0] [get_bd_pins ila_0/probe32]
connect_bd_net [get_bd_pins Maxpool_Layer_32bit_0/ila_row_cntrl_kernel_data_1] [get_bd_pins ila_0/probe33]
connect_bd_net [get_bd_pins Maxpool_Layer_32bit_0/ila_row_cntrl_kernel_data_2] [get_bd_pins ila_0/probe34]
connect_bd_net [get_bd_pins Maxpool_Layer_32bit_0/ila_row_cntrl_kernel_data_3] [get_bd_pins ila_0/probe35]
connect_bd_net [get_bd_pins Maxpool_Layer_32bit_0/ila_row_cntrl_kernel_data_4] [get_bd_pins ila_0/probe36]
connect_bd_net [get_bd_pins Maxpool_Layer_32bit_0/ila_row_cntrl_kernel_data_5] [get_bd_pins ila_0/probe37]
connect_bd_net [get_bd_pins Maxpool_Layer_32bit_0/ila_row_cntrl_kernel_data_6] [get_bd_pins ila_0/probe38]
connect_bd_net [get_bd_pins Maxpool_Layer_32bit_0/ila_row_cntrl_kernel_data_7] [get_bd_pins ila_0/probe39]
connect_bd_net [get_bd_pins Maxpool_Layer_32bit_0/ila_row_cntrl_kernel_data_8] [get_bd_pins ila_0/probe40]
connect_bd_net [get_bd_pins Maxpool_Layer_32bit_0/ila_row_cntrl_kernel_data_9] [get_bd_pins ila_0/probe41]
connect_bd_net [get_bd_pins Maxpool_Layer_32bit_0/ila_row_cntrl_sorter_data_0] [get_bd_pins ila_0/probe42]
connect_bd_net [get_bd_pins Maxpool_Layer_32bit_0/ila_row_cntrl_sorter_data_1] [get_bd_pins ila_0/probe43]
connect_bd_net [get_bd_pins Maxpool_Layer_32bit_0/ila_row_cntrl_sorter_data_2] [get_bd_pins ila_0/probe44]
connect_bd_net [get_bd_pins Maxpool_Layer_32bit_0/ila_row_cntrl_sorter_data_3] [get_bd_pins ila_0/probe45]
connect_bd_net [get_bd_pins Maxpool_Layer_32bit_0/ila_row_cntrl_sorter_data_4] [get_bd_pins ila_0/probe46]
connect_bd_net [get_bd_pins Maxpool_Layer_32bit_0/ila_row_cntrl_sorter_data_5] [get_bd_pins ila_0/probe47]
connect_bd_net [get_bd_pins Maxpool_Layer_32bit_0/ila_row_cntrl_sorter_data_6] [get_bd_pins ila_0/probe48]
connect_bd_net [get_bd_pins Maxpool_Layer_32bit_0/ila_row_cntrl_sorter_data_7] [get_bd_pins ila_0/probe49]
connect_bd_net [get_bd_pins Maxpool_Layer_32bit_0/ila_row_cntrl_sorter_data_8] [get_bd_pins ila_0/probe50]
connect_bd_net [get_bd_pins Maxpool_Layer_32bit_0/ila_row_cntrl_sorter_data_9] [get_bd_pins ila_0/probe51]
connect_bd_net [get_bd_pins Maxpool_Layer_32bit_0/ila_PR0_full] [get_bd_pins ila_0/probe52]
connect_bd_net [get_bd_pins Maxpool_Layer_32bit_0/ila_PR0_almost_full] [get_bd_pins ila_0/probe53]
connect_bd_net [get_bd_pins Maxpool_Layer_32bit_0/ila_PR0_empty] [get_bd_pins ila_0/probe54]
connect_bd_net [get_bd_pins Maxpool_Layer_32bit_0/ila_PR0_almost_empty] [get_bd_pins ila_0/probe55]
connect_bd_net [get_bd_pins Maxpool_Layer_32bit_0/ila_PR1_full] [get_bd_pins ila_0/probe56]
connect_bd_net [get_bd_pins Maxpool_Layer_32bit_0/ila_PR1_almost_full] [get_bd_pins ila_0/probe57]
connect_bd_net [get_bd_pins Maxpool_Layer_32bit_0/ila_PR1_empty] [get_bd_pins ila_0/probe58]
connect_bd_net [get_bd_pins Maxpool_Layer_32bit_0/ila_PR1_almost_empty] [get_bd_pins ila_0/probe59]
connect_bd_net [get_bd_pins Maxpool_Layer_32bit_0/ila_PR2_full] [get_bd_pins ila_0/probe60]
connect_bd_net [get_bd_pins Maxpool_Layer_32bit_0/ila_PR2_almost_full] [get_bd_pins ila_0/probe61]
connect_bd_net [get_bd_pins Maxpool_Layer_32bit_0/ila_PR2_empty] [get_bd_pins ila_0/probe62]
connect_bd_net [get_bd_pins Maxpool_Layer_32bit_0/ila_PR2_almost_empty] [get_bd_pins ila_0/probe63]
connect_bd_net [get_bd_pins Maxpool_Layer_32bit_0/ila_inbuff_wr_en] [get_bd_pins ila_1/probe0]
connect_bd_net [get_bd_pins Maxpool_Layer_32bit_0/ila_inbuff_empty] [get_bd_pins ila_1/probe1]
connect_bd_net [get_bd_pins Maxpool_Layer_32bit_0/ila_inbuff_almost_empty] [get_bd_pins ila_1/probe2]
connect_bd_net [get_bd_pins Maxpool_Layer_32bit_0/ila_inbuff_full] [get_bd_pins ila_1/probe3]
connect_bd_net [get_bd_pins Maxpool_Layer_32bit_0/ila_inbuff_almost_full] [get_bd_pins ila_1/probe4]
connect_bd_net [get_bd_pins Maxpool_Layer_32bit_0/ila_inbuff_valid] [get_bd_pins ila_1/probe5]
connect_bd_net [get_bd_pins Maxpool_Layer_32bit_0/ila_inbuff_rd_en] [get_bd_pins ila_1/probe6]
connect_bd_net [get_bd_pins Maxpool_Layer_32bit_0/ila_outbuff_rd_en] [get_bd_pins ila_1/probe7]
connect_bd_net [get_bd_pins Maxpool_Layer_32bit_0/ila_outbuff_dout] [get_bd_pins ila_1/probe8]
connect_bd_net [get_bd_pins Maxpool_Layer_32bit_0/ila_outbuff_empty] [get_bd_pins ila_1/probe9]
connect_bd_net [get_bd_pins Maxpool_Layer_32bit_0/ila_outbuff_full] [get_bd_pins ila_1/probe11]
connect_bd_net [get_bd_pins Maxpool_Layer_32bit_0/ila_outbuff_almost_full] [get_bd_pins ila_1/probe12]
connect_bd_net [get_bd_pins Maxpool_Layer_32bit_0/ila_outbuff_valid] [get_bd_pins ila_1/probe13]
connect_bd_net [get_bd_pins Maxpool_Layer_32bit_0/ila_heap_sorter_ready] [get_bd_pins ila_1/probe14]
connect_bd_net [get_bd_pins Maxpool_Layer_32bit_0/ila_heap_sorter_fsm_state] [get_bd_pins ila_1/probe15]
connect_bd_net [get_bd_pins Maxpool_Layer_32bit_0/ila_heap_sorter_position1] [get_bd_pins ila_1/probe16]
connect_bd_net [get_bd_pins Maxpool_Layer_32bit_0/ila_heap_sorter_position2] [get_bd_pins ila_1/probe17]
connect_bd_net [get_bd_pins Maxpool_Layer_32bit_0/ila_heap_sorter_position3] [get_bd_pins ila_1/probe18]
connect_bd_net [get_bd_pins Maxpool_Layer_32bit_0/ila_heap_sorter_position4] [get_bd_pins ila_1/probe19]
connect_bd_net [get_bd_pins Maxpool_Layer_32bit_0/ila_heap_sorter_position5] [get_bd_pins ila_1/probe20]
connect_bd_net [get_bd_pins Maxpool_Layer_32bit_0/ila_heap_sorter_position6] [get_bd_pins ila_1/probe21]
connect_bd_net [get_bd_pins Maxpool_Layer_32bit_0/ila_heap_sorter_position7] [get_bd_pins ila_1/probe22]
connect_bd_net [get_bd_pins Maxpool_Layer_32bit_0/ila_heap_sorter_position8] [get_bd_pins ila_1/probe23]
connect_bd_net [get_bd_pins Maxpool_Layer_32bit_0/ila_heap_sorter_position9] [get_bd_pins ila_1/probe24]
connect_bd_net [get_bd_pins Maxpool_Layer_32bit_0/ila_heap_sorter_done] [get_bd_pins ila_1/probe25]
connect_bd_net [get_bd_pins Maxpool_Layer_32bit_0/ila_heap_sorter_sorted_data_0] [get_bd_pins ila_1/probe26]
connect_bd_net [get_bd_pins Maxpool_Layer_32bit_0/ila_heap_sorter_sorted_data_1] [get_bd_pins ila_1/probe27]
connect_bd_net [get_bd_pins Maxpool_Layer_32bit_0/ila_heap_sorter_sorted_data_2] [get_bd_pins ila_1/probe28]
connect_bd_net [get_bd_pins Maxpool_Layer_32bit_0/ila_heap_sorter_sorted_data_3] [get_bd_pins ila_1/probe29]
connect_bd_net [get_bd_pins Maxpool_Layer_32bit_0/ila_heap_sorter_sorted_data_4] [get_bd_pins ila_1/probe30]
connect_bd_net [get_bd_pins Maxpool_Layer_32bit_0/ila_heap_sorter_sorted_data_5] [get_bd_pins ila_1/probe31]
connect_bd_net [get_bd_pins Maxpool_Layer_32bit_0/ila_heap_sorter_sorted_data_6] [get_bd_pins ila_1/probe32]
connect_bd_net [get_bd_pins Maxpool_Layer_32bit_0/ila_heap_sorter_sorted_data_7] [get_bd_pins ila_1/probe33]
connect_bd_net [get_bd_pins Maxpool_Layer_32bit_0/ila_heap_sorter_sorted_data_8] [get_bd_pins ila_1/probe34]
connect_bd_net [get_bd_pins Maxpool_Layer_32bit_0/ila_heap_sorter_sorted_data_9] [get_bd_pins ila_1/probe35]
connect_bd_net [get_bd_pins Maxpool_Layer_32bit_0/ila_heap_sorter_sorter_ready] [get_bd_pins ila_1/probe36]
connect_bd_net [get_bd_pins Maxpool_Layer_32bit_0/ila_master_fsm_state] [get_bd_pins ila_1/probe37]
connect_bd_net [get_bd_pins Maxpool_Layer_32bit_0/ila_master_axi_awready] [get_bd_pins ila_1/probe38]
connect_bd_net [get_bd_pins Maxpool_Layer_32bit_0/ila_master_axi_awaddr] [get_bd_pins ila_1/probe39]
connect_bd_net [get_bd_pins Maxpool_Layer_32bit_0/ila_master_axi_awsize] [get_bd_pins ila_1/probe40]
connect_bd_net [get_bd_pins Maxpool_Layer_32bit_0/ila_master_axi_awlen] [get_bd_pins ila_1/probe41]
connect_bd_net [get_bd_pins Maxpool_Layer_32bit_0/ila_master_axi_awvalid] [get_bd_pins ila_1/probe42]
connect_bd_net [get_bd_pins Maxpool_Layer_32bit_0/ila_master_axi_wready] [get_bd_pins ila_1/probe43]
connect_bd_net [get_bd_pins Maxpool_Layer_32bit_0/ila_master_axi_wdata] [get_bd_pins ila_1/probe44]
connect_bd_net [get_bd_pins Maxpool_Layer_32bit_0/ila_master_axi_wlast] [get_bd_pins ila_1/probe45]
connect_bd_net [get_bd_pins Maxpool_Layer_32bit_0/ila_master_axi_wvalid] [get_bd_pins ila_1/probe46]
connect_bd_net [get_bd_pins Maxpool_Layer_32bit_0/ila_master_axi_wstrb] [get_bd_pins ila_1/probe47]
connect_bd_net [get_bd_pins Maxpool_Layer_32bit_0/ila_master_axi_bvalid] [get_bd_pins ila_1/probe48]
connect_bd_net [get_bd_pins Maxpool_Layer_32bit_0/ila_master_axi_bready] [get_bd_pins ila_1/probe49]
connect_bd_net [get_bd_pins Maxpool_Layer_32bit_0/ila_master_axi_wbc] [get_bd_pins ila_1/probe50]
connect_bd_net [get_bd_pins Maxpool_Layer_32bit_0/ila_master_axi_arsize] [get_bd_pins ila_1/probe51]
connect_bd_net [get_bd_pins Maxpool_Layer_32bit_0/ila_master_axi_araddr] [get_bd_pins ila_1/probe52]
connect_bd_net [get_bd_pins Maxpool_Layer_32bit_0/ila_master_axi_arlen] [get_bd_pins ila_1/probe53]
connect_bd_net [get_bd_pins Maxpool_Layer_32bit_0/ila_master_axi_arvalid] [get_bd_pins ila_1/probe54]
connect_bd_net [get_bd_pins Maxpool_Layer_32bit_0/ila_master_axi_rready] [get_bd_pins ila_1/probe55]
connect_bd_net [get_bd_pins Maxpool_Layer_32bit_0/ila_master_axi_arready] [get_bd_pins ila_1/probe56]
connect_bd_net [get_bd_pins Maxpool_Layer_32bit_0/ila_master_axi_rdata] [get_bd_pins ila_1/probe57]
connect_bd_net [get_bd_pins Maxpool_Layer_32bit_0/ila_master_axi_rlast] [get_bd_pins ila_1/probe58]
connect_bd_net [get_bd_pins Maxpool_Layer_32bit_0/ila_master_axi_rvalid] [get_bd_pins ila_1/probe59]
connect_bd_net [get_bd_pins Maxpool_Layer_32bit_0/ila_master_axi_rbc] [get_bd_pins ila_1/probe60]
connect_bd_net [get_bd_pins Maxpool_Layer_32bit_0/ila_master_outbuff_rd_en] [get_bd_pins ila_1/probe61]
connect_bd_net [get_bd_pins Maxpool_Layer_32bit_0/ila_master_inbuff_din] [get_bd_pins ila_2/probe0]
connect_bd_net [get_bd_pins Maxpool_Layer_32bit_0/ila_master_inbuff_wr_en] [get_bd_pins ila_2/probe1]
connect_bd_net [get_bd_pins Maxpool_Layer_32bit_0/ila_master_input_volume_size] [get_bd_pins ila_2/probe2]
connect_bd_net [get_bd_pins Maxpool_Layer_32bit_0/ila_master_input_volume_channels] [get_bd_pins ila_2/probe3]
connect_bd_net [get_bd_pins Maxpool_Layer_32bit_0/ila_master_output_volume_size] [get_bd_pins ila_2/probe4]
connect_bd_net [get_bd_pins Maxpool_Layer_32bit_0/ila_master_output_volume_channels] [get_bd_pins ila_2/probe5]
connect_bd_net [get_bd_pins Maxpool_Layer_32bit_0/ila_master_pool_kernel_size] [get_bd_pins ila_2/probe6]
connect_bd_net [get_bd_pins Maxpool_Layer_32bit_0/ila_master_stride] [get_bd_pins ila_2/probe7]
connect_bd_net [get_bd_pins Maxpool_Layer_32bit_0/ila_master_input_data_addr_reg] [get_bd_pins ila_2/probe8]
connect_bd_net [get_bd_pins Maxpool_Layer_32bit_0/ila_master_output_data_addr_reg] [get_bd_pins ila_2/probe9]
connect_bd_net [get_bd_pins Maxpool_Layer_32bit_0/ila_master_row_counter] [get_bd_pins ila_2/probe10]
connect_bd_net [get_bd_pins Maxpool_Layer_32bit_0/ila_master_channel_counter] [get_bd_pins ila_2/probe11]
connect_bd_net [get_bd_pins Maxpool_Layer_32bit_0/ila_master_writes_remaining] [get_bd_pins ila_2/probe12]
connect_bd_net [get_bd_pins Maxpool_Layer_32bit_0/ila_master_calculated] [get_bd_pins ila_2/probe13]
connect_bd_net [get_bd_pins Maxpool_Layer_32bit_0/ila_master_more_bursts_needed] [get_bd_pins ila_2/probe14]
connect_bd_net [get_bd_pins Maxpool_Layer_32bit_0/ila_master_channel_complete_counter] [get_bd_pins ila_2/probe15]
connect_bd_net [get_bd_pins Maxpool_Layer_32bit_0/ila_master_complete_shift_reg] [get_bd_pins ila_2/probe16]
connect_bd_net [get_bd_pins Maxpool_Layer_32bit_0/ila_master_data_valid] [get_bd_pins ila_2/probe17]
connect_bd_net [get_bd_pins Maxpool_Layer_32bit_0/ila_master_operating_length] [get_bd_pins ila_2/probe18]
connect_bd_net [get_bd_pins Maxpool_Layer_32bit_0/ila_master_input_index] [get_bd_pins ila_2/probe19]
connect_bd_net [get_bd_pins Maxpool_Layer_32bit_0/ila_master_input_addr_counter] [get_bd_pins ila_2/probe20]
connect_bd_net [get_bd_pins Maxpool_Layer_32bit_0/ila_master_stride_counter] [get_bd_pins ila_2/probe21]
connect_bd_net [get_bd_pins Maxpool_Layer_32bit_0/ila_master_addr1_multiple] [get_bd_pins ila_2/probe22]
connect_bd_net [get_bd_pins Maxpool_Layer_32bit_0/ila_master_addr2_multiple] [get_bd_pins ila_2/probe23]
connect_bd_net [get_bd_pins Maxpool_Layer_32bit_0/ila_master_start] [get_bd_pins ila_2/probe24]
connect_bd_net [get_bd_pins Maxpool_Layer_32bit_0/ila_master_start_reg] [get_bd_pins ila_2/probe25]
connect_bd_net [get_bd_pins Maxpool_Layer_32bit_0/ila_master_first_calculated] [get_bd_pins ila_2/probe26]
connect_bd_net [get_bd_pins Softmax_Layer_32bit_0/ila_smax_ctrlr_busy] [get_bd_ports softmax_busy]
connect_bd_net [get_bd_pins Convolution_Layer_32bit_0/ila_master_busy] [get_bd_ports conv_busy]

# ---- address map ----
assign_bd_address -offset 0x80000000 -range 512M -target_address_space [get_bd_addr_spaces Convolution_Layer_32bit_0/M00_AXI] [get_bd_addr_segs mig_7series_0/memmap/memaddr]
assign_bd_address -offset 0x80000000 -range 512M -target_address_space [get_bd_addr_spaces Maxpool_Layer_32bit_0/M00_AXI] [get_bd_addr_segs mig_7series_0/memmap/memaddr]
assign_bd_address -offset 0x00000000 -range 64K -target_address_space [get_bd_addr_spaces mdm_1/Data] [get_bd_addr_segs microblaze_0_local_memory/dlmb_bram_if_cntlr/SLMB1/Mem]
assign_bd_address -offset 0x80000000 -range 512M -target_address_space [get_bd_addr_spaces mdm_1/Data] [get_bd_addr_segs mig_7series_0/memmap/memaddr]
assign_bd_address -offset 0x00000000 -range 64K -target_address_space [get_bd_addr_spaces microblaze_0/Data] [get_bd_addr_segs microblaze_0_local_memory/dlmb_bram_if_cntlr/SLMB/Mem]
assign_bd_address -offset 0x40600000 -range 64K -target_address_space [get_bd_addr_spaces microblaze_0/Data] [get_bd_addr_segs axi_uartlite_0/S_AXI/Reg]
assign_bd_address -offset 0x41200000 -range 64K -target_address_space [get_bd_addr_spaces microblaze_0/Data] [get_bd_addr_segs microblaze_0_axi_intc/S_AXI/Reg]
assign_bd_address -offset 0x44A00000 -range 64K -target_address_space [get_bd_addr_spaces microblaze_0/Data] [get_bd_addr_segs Convolution_Layer_32bit_0/S00_AXI/S00_AXI_reg]
assign_bd_address -offset 0x44A10000 -range 64K -target_address_space [get_bd_addr_spaces microblaze_0/Data] [get_bd_addr_segs Maxpool_Layer_32bit_0/S00_AXI/S00_AXI_reg]
assign_bd_address -offset 0x44A20000 -range 64K -target_address_space [get_bd_addr_spaces microblaze_0/Data] [get_bd_addr_segs Softmax_Layer_32bit_0/S00_AXI/S00_AXI_reg]
assign_bd_address -offset 0x44A30000 -range 64K -target_address_space [get_bd_addr_spaces microblaze_0/Data] [get_bd_addr_segs VGA_IF_0/S00_AXI/S00_AXI_reg]
assign_bd_address -offset 0x44A40000 -range 64K -target_address_space [get_bd_addr_spaces microblaze_0/Data] [get_bd_addr_segs VGA_IF_0/S_AXI_INTR/S_AXI_INTR_reg]
assign_bd_address -offset 0x44A50000 -range 64K -target_address_space [get_bd_addr_spaces microblaze_0/Data] [get_bd_addr_segs xadc_wiz_0/s_axi_lite/Reg]
assign_bd_address -offset 0x80000000 -range 512M -target_address_space [get_bd_addr_spaces microblaze_0/Data] [get_bd_addr_segs mig_7series_0/memmap/memaddr]
assign_bd_address -offset 0x00000000 -range 64K -target_address_space [get_bd_addr_spaces microblaze_0/Instruction] [get_bd_addr_segs microblaze_0_local_memory/ilmb_bram_if_cntlr/SLMB/Mem]
assign_bd_address -offset 0x80000000 -range 512M -target_address_space [get_bd_addr_spaces microblaze_0/Instruction] [get_bd_addr_segs mig_7series_0/memmap/memaddr]
assign_bd_address -offset 0x80000000 -range 512M -target_address_space [get_bd_addr_spaces Softmax_Layer_32bit_0/M00_AXI] [get_bd_addr_segs mig_7series_0/memmap/memaddr]
assign_bd_address -offset 0x80000000 -range 512M -target_address_space [get_bd_addr_spaces VGA_IF_0/M00_AXI] [get_bd_addr_segs mig_7series_0/memmap/memaddr]

validate_bd_design
save_bd_design
